# Altium schematic sheet Sheet1.SchDoc
size A4; SheetNumber: 1; SheetTotal: 1
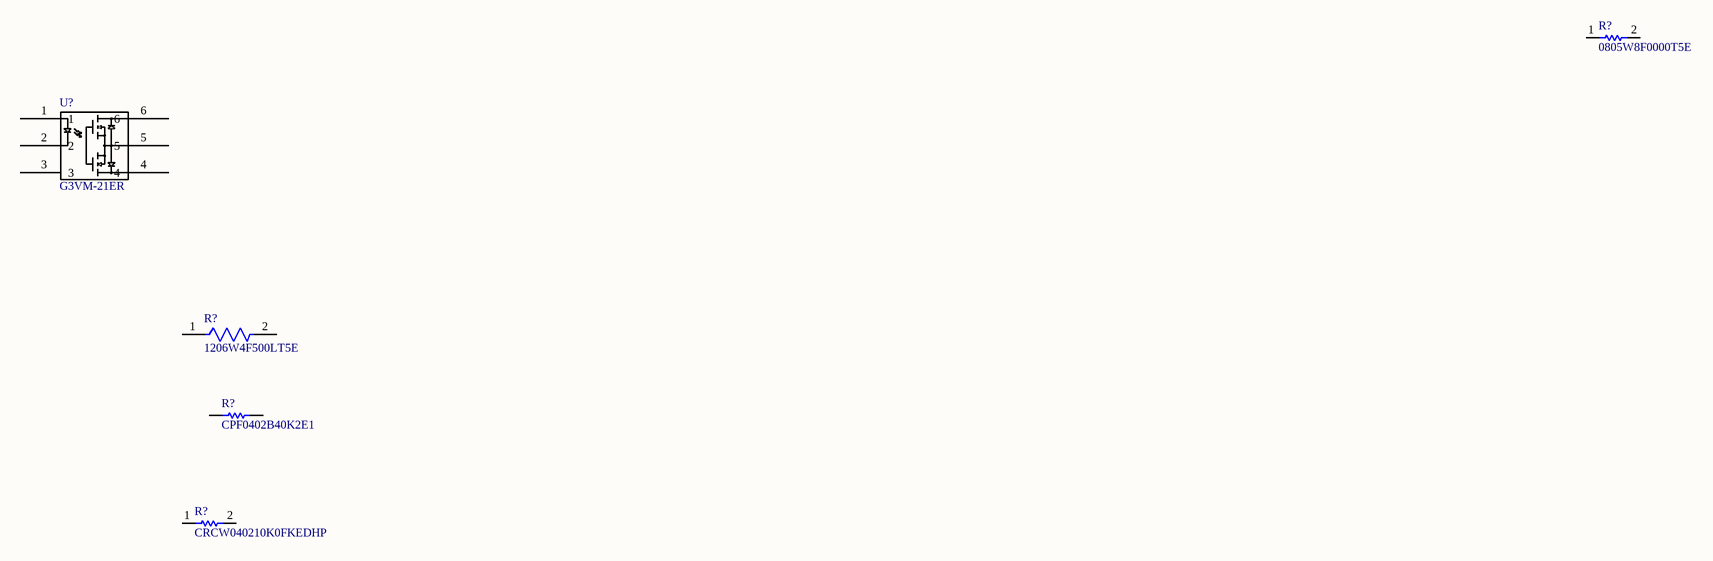
[diagram p0: Sheet1.SchDoc]

## Parts
(Parts that share a designator on the sheet are numbered #1, #2 ... from top to bottom, then left to right.)
R?#1  0805W8F0000T5E  [0805W8F0000T5E-Footprint-1]
R?#2  1206W4F500LT5E  [1206W4F500LT5E-Footprint-1]
R?#3  CPF0402B40K2E1  [RESC1005X35X20LL05T10]
R?#4  CRCW040210K0FKEDHP  [RESC1005X40X25NL05T10]
U?  G3VM-21ER  [G3VM-21ER-Footprint-1]

## Nets

Not connected (* = marked no-connect by the designer): R?#1 1 2; R?#2 1 2; R?#3 1 2; R?#4 1 2; U? 1 2 3 4 5 6

## Library data of the parts
R?#1 = CMP-003-00443-2: -55℃~+155℃ 0Ω 125mW 150V Thick Film Resistor ±1% ±800ppm/℃ 0805 Chip Resistor - Surface Mount ROHS; LCSC Part #: C17477
R?#2 = CMP-003-00393-1: -55℃~+155℃ 200V 250mW 500mΩ Thick Film Resistor ±1% ±800ppm/℃ 1206 Chip Resistor - Surface Mount ROHS; LCSC Part #: C25340
R?#3 = CMP-003-00249-1: Res Thin Film 0402 40.2K Ohm 0.1% 1/16W ±25ppm/°C Molded SMD SMD Paper T/R; Min Operating Temperature: -55°C; Width: 500µm; Max Operating Temperature: 155°C; Depth: 500µm; LCSC Part #: C4234771; Length: 990.6µm; Tolerance: 0.1%; Height: 300µm; Termination: Solder; Case/Package: 0402
R?#4 = CMP-003-00415-2: Res Thick Film 0402 10K Ohm 1% 0.2W ±100ppm/°C Molded SMD SMD Paper T/R; Max Operating Temperature: 155°C; Termination: SMD/SMT; Length: 1mm; Height: 300µm; Depth: 500µm; Lead Free: Lead Free; Packaging: Cut Tape; Pins: 2; Case/Package: 0402; Min Operating Temperature: -55°C; Tolerance: 1%; LCSC Part #: C71617; Width: 500µm
U? = CMP-003-00232-1: Relay SSR 25mA 1.48V DC-IN 4A 16V AC/DC-OUT 6-Pin DIP SMD Stick; Length: 7.12mm; Height: 3.65mm; Max Operating Temperature: 65°C; Termination: Gull Wing; LCSC Part #: C6258783; Width: 6.4mm; Case/Package: SMD/SMT; Min Operating Temperature: -20°C; Pins: 6